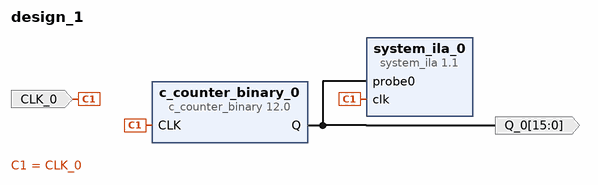
[diagram p0: block diagram of the top level]
# Vivado block design design_1, xc7a35tcpg236-1, Vivado 2024.1
create_bd_design design_1

create_bd_port -dir I -type clk CLK_0
set_property -dict {CONFIG.FREQ_HZ 10000000} [get_bd_ports CLK_0]
create_bd_port -dir O -from 15 -to 0 -type data Q_0

create_bd_cell -type ip -vlnv xilinx.com:ip:c_counter_binary:12.0 c_counter_binary_0
create_bd_cell -type ip -vlnv xilinx.com:ip:system_ila:1.1 system_ila_0
set_property -dict [list \
  CONFIG.C_DATA_DEPTH 1024 \
  CONFIG.C_MON_TYPE NATIVE \
  CONFIG.C_NUM_OF_PROBES 1 \
  CONFIG.C_PROBE0_TYPE 0 \
] [get_bd_cells system_ila_0]

# ---- connections ----

connect_bd_net -net CLK_0_1 [get_bd_ports CLK_0] [get_bd_pins c_counter_binary_0/CLK] [get_bd_pins system_ila_0/clk]
connect_bd_net -net c_counter_binary_0_Q [get_bd_pins c_counter_binary_0/Q] [get_bd_ports Q_0] [get_bd_pins system_ila_0/probe0]
set_property HDL_ATTRIBUTE.DEBUG true [get_bd_nets c_counter_binary_0_Q]
set_property HDL_ATTRIBUTE.MARK_DEBUG true [get_bd_nets c_counter_binary_0_Q]

validate_bd_design
save_bd_design
